# EAGLE design ADXL345_Breakout-v13 (EAGLE 5.00)
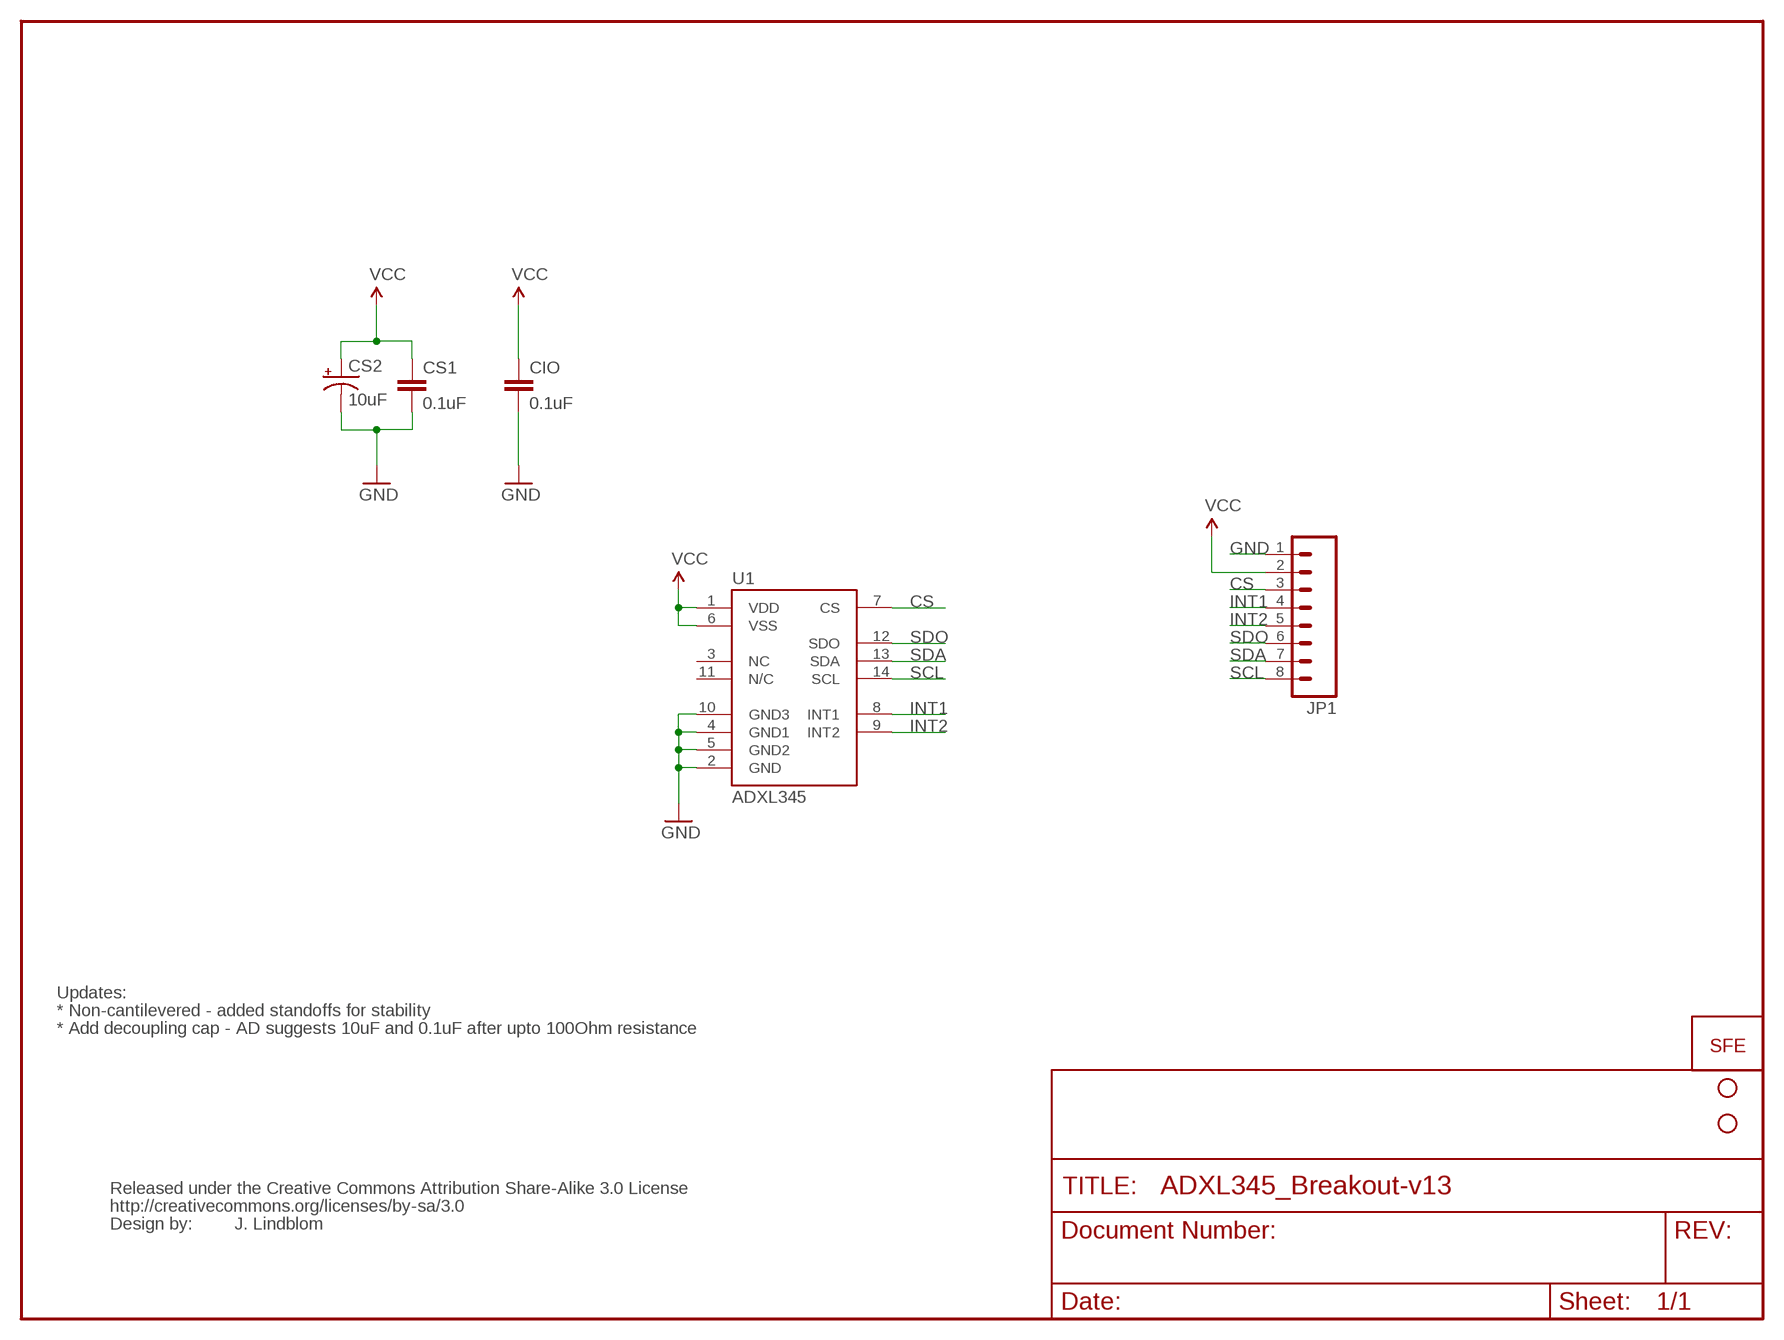
[diagram p0: schematic, sheet 1]

## Parts
CIO  0.1uF  CAP0402-CAP  [0402-CAP]
CS1  0.1uF  CAP0402-CAP  [0402-CAP]
CS2  10uF  CAP_POL1206  [EIA3216]
JP1  M08  [1X08]
JP2  STAND-OFF  [STAND-OFF]
JP3  STAND-OFF  [STAND-OFF]
U1  ADXL345  [LGA14]
U$1  CREATIVE_COMMONS  [CREATIVE_COMMONS]
U$2  LOGO-SFENEW  [SFE-NEW-WEBLOGO]

## Nets
CS: JP1.3 U1.7(CS)
GND: CIO.2 CS1.2 CS2.C(-) JP1.1 U1.2(GND) U1.4(GND1) U1.5(GND2) U1.10(GND3)
INT1: JP1.4 U1.8(INT1)
INT2: JP1.5 U1.9(INT2)
SCL: JP1.8 U1.14(SCL)
SDA: JP1.7 U1.13(SDA)
SDO: JP1.6 U1.12(SDO)
VCC: CIO.1 CS1.1 CS2.A(+) JP1.2 U1.1(VDD) U1.6(VSS)
Unconnected: U1.3(NC) U1.11(N/C)

## Notes on the sheet
- Updates:
- * Non-cantilevered - added standoffs for stability
- * Add decoupling cap - AD suggests 10uF and 0.1uF after upto 100Ohm resistance
- J. Lindblom

## Library data of the parts
CIO CS1 = SparkFun:CAP: Capacitor Standard 0603 ceramic capacitor, and 0.1" leaded capacitor.
CS2 = SparkFun:CAP_POL: Capacitor Polarized These are standard SMD and PTH capacitors. Normally 10uF, 47uF, and 100uF in electrolytic and tantalum varieties. Always verify the external diameter of the through hole cap, it varies with capacity, voltage, and manufacturer. The EIA devices should be standard.
JP1 = SparkFun:M08: Header 8 Standard 8-pin 0.1" header. Use with straight break away headers (SKU : PRT-00116), right angle break away headers (PRT-00553), swiss pins (PRT-00743), machine pins (PRT-00117), and female headers (PRT-00115).
JP2 JP3 = SparkFun:STAND-OFF: Stand Off This is the mechanical footprint for a #4 phillips button head screw. Use the keepout ring to avoid running the screw head into surrounding components. SKU : PRT-00447
U1 = SparkFun:ADXL345
U$1 = SparkFun:CREATIVE_COMMONS
U$2 = SparkFun:LOGO-SFE: Spark Fun Electronics PCB Logo This is the standard Spark Fun Electronics PCB logo.

## Board
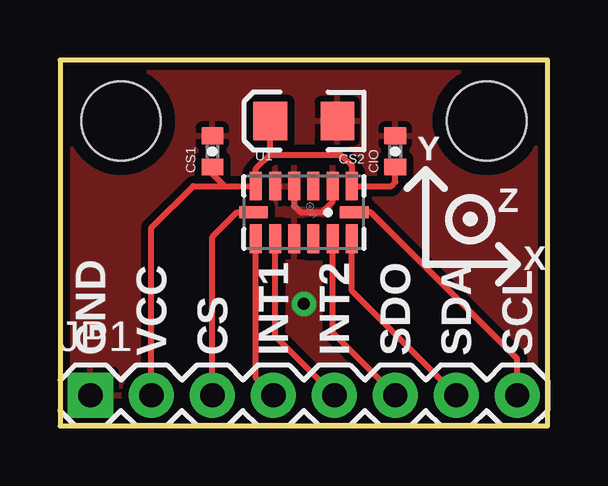
[diagram p1: board, top side]
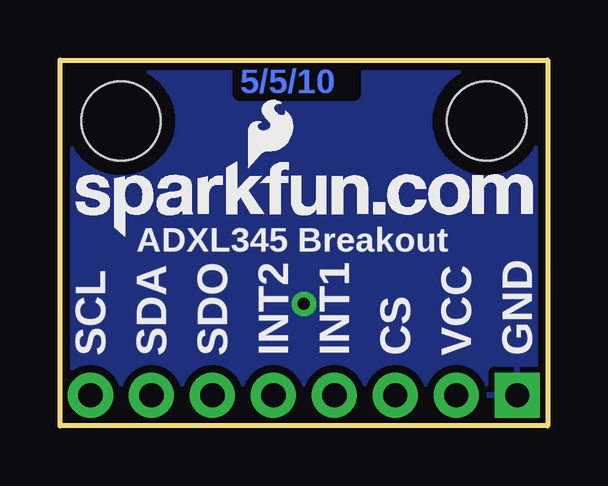
[diagram p2: board, bottom side, seen from below]

Size 20.32 x 15.24 mm. Coordinates in mm from the lower left corner, seen from the top.
Outline: 0,0 20.32,0 20.32,15.24 0,15.24 0,0
Copper layers (1*16): Top 0.035mm / dielectric 1.5mm / Bottom 0.035mm
Design rules "SparkFun": minimum track width 8mil, minimum drill 20mil, track to track 8mil, track to pad 8mil, pad to pad 8mil, via to via 8mil, smd to smd 8mil, copper to edge 8mil, drill to drill 8mil, minimum pad ring 12mil, minimum via ring 10mil, stop-mask expansion 4mil, vias tented up to drill 20mil, thermal gap 10mil

### Footprints (pad centres in the part's own frame; a part is rotated, then mirrored left to right if it is on the bottom)
0402-CAP = smd 0.7 x 0.9: 1 -0.65,0; 2 0.65,0
EIA3216 = smd 1.4 x 1.6: A 1.4,0; C -1.4,0
1X08 = drill 1.016 pad 1.88 square: 1 0,0 | drill 1.016 pad 1.88 round: 2 2.54,0; 3 5.08,0; 4 7.62,0; 5 10.16,0; 6 12.7,0; 7 15.24,0; 8 17.78,0
STAND-OFF = hole 3.302: 0,0
LGA14 = smd 0.5 x 1.2: 1 2,1.1; 2 1.2,1.1; 3 0.4,1.1; 4 -0.4,1.1; 5 -1.2,1.1; 6 -2,1.1; 8 -2,-1.1; 9 -1.2,-1.1; 10 -0.4,-1.1; 11 0.4,-1.1; 12 1.2,-1.1; 13 2,-1.1 | smd 1.2 x 0.5: 7 -2.1,0; 14 2.1,0

### Placement (x,y rotation side)
CIO  13.97,11.43 90 top
CS1  6.35,11.43 90 top
CS2  10.16,12.7 180 top
JP1  1.27,1.27 0 top
JP2  2.54,12.7 0 top
JP3  17.78,12.7 0 top
U1  10.16,8.89 0 top
U$1  0,-7.62 0 top  (outside the outline)
U$2  19.68,7.87 0 bottom

### Tracks (layer width: path | path; a pad name or v marks a point on that pad's centre or on a via)
CS
  Top 0.254: U1.7 7.37,8.89 6.35,7.87 JP1.3
GND  (via drill 0.51)
  Top 0.254: U1.2 11.36,9.33 10.92,8.89 10.03,8.89 9.76,9.16 U1.4
  other vias: 10.16,5.08
  pour Top (isolate 0.305): 0,0 0,15.24 20.32,15.24 20.32,0
  pour Bottom (isolate 0.305): 0,0 0,15.24 20.32,15.24 20.32,0
INT1
  Top 0.254: U1.8 8.16,2 JP1.4
INT2
  Top 0.254: U1.9 8.96,3.74 JP1.5
SCL
  Top 0.254: U1.14 12.95,8.89 19.05,2.79 JP1.8
SDA
  Top 0.254: U1.13 12.16,5.62 JP1.7
SDO
  Top 0.254: U1.12 11.36,3.88 JP1.6
VCC
  Top 0.254: 8.76,11.3 8.16,10.7 U1.6 6.86,9.99 | 8.76,11.3 CS2.A | 8.76,11.3 11.69,11.3 12.16,10.83 U1.1 13.8,9.99 13.97,10.16 CIO.1 | JP1.2 3.81,8.26 5.54,9.99 6.86,9.99 | CS1.1 6.35,10.5 6.86,9.99

### Text on the board
Bottom: 5/5/10
tPlace: Y | Z | X | GND | VCC | CS | INT1 | INT2 | SDO | SDA | SCL
bPlace: ADXL345 Breakout | GND | VCC | CS | INT1 | INT2 | SDO | SDA | SCL
tNames: J. Lindblom